# EAGLE design lcd1602a-connector (EAGLE 7.2.0)
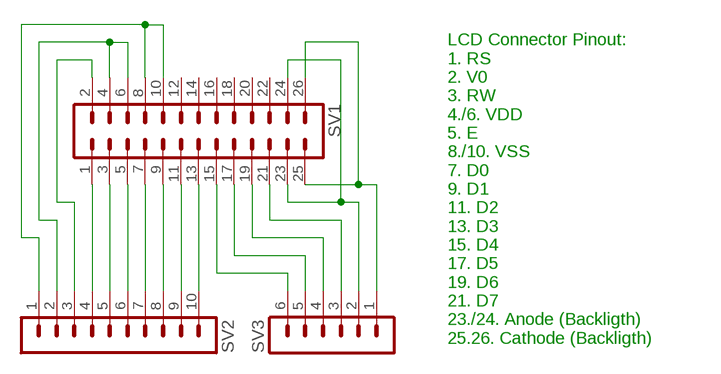
[diagram p0: schematic, sheet 1]

## Parts
SV1  ML26  [ML26]
SV2  MA10-1  [MA10-1]
SV3  MA06-1  [MA06-1]

## Nets
N$1: SV1.1 SV2.4
N$2: SV1.3 SV2.5
N$3: SV1.5 SV2.6
N$4: SV1.7 SV2.7
N$5: SV1.9 SV2.8
N$6: SV1.11 SV2.9
N$7: SV1.13 SV2.10
N$8: SV1.15 SV3.6
N$9: SV1.17 SV3.5
N$10: SV1.21 SV3.3
N$11: SV1.23 SV1.24 SV3.2
N$12: SV1.19 SV3.4
N$13: SV1.25 SV1.26 SV3.1
N$14: SV1.2 SV2.3
N$15: SV1.4 SV1.6 SV2.2
N$16: SV1.8 SV1.10 SV2.1
Unconnected: SV1.12 SV1.14 SV1.16 SV1.18 SV1.20 SV1.22

## Notes on the sheet
- LCD Connector Pinout:
  1. RS
  2. V0
  3. RW
  4./6. VDD
  5. E
  8./10. VSS
  7. D0
  9. D1
  11. D2
  13. D3
  15. D4
  17. D5
  19. D6
  21. D7
  23./24. Anode (Backligth)
  25.26. Cathode (Backligth)

## Library data of the parts
SV1 = con-harting-ml:ML26: HARTING; OC_FARNELL: unknown; OC_NEWARK: unknown
SV2 = con-lstb:MA10-1: PIN HEADER; OC_FARNELL: unknown; OC_NEWARK: unknown
SV3 = con-lstb:MA06-1: PIN HEADER; OC_FARNELL: unknown; OC_NEWARK: unknown

## Board
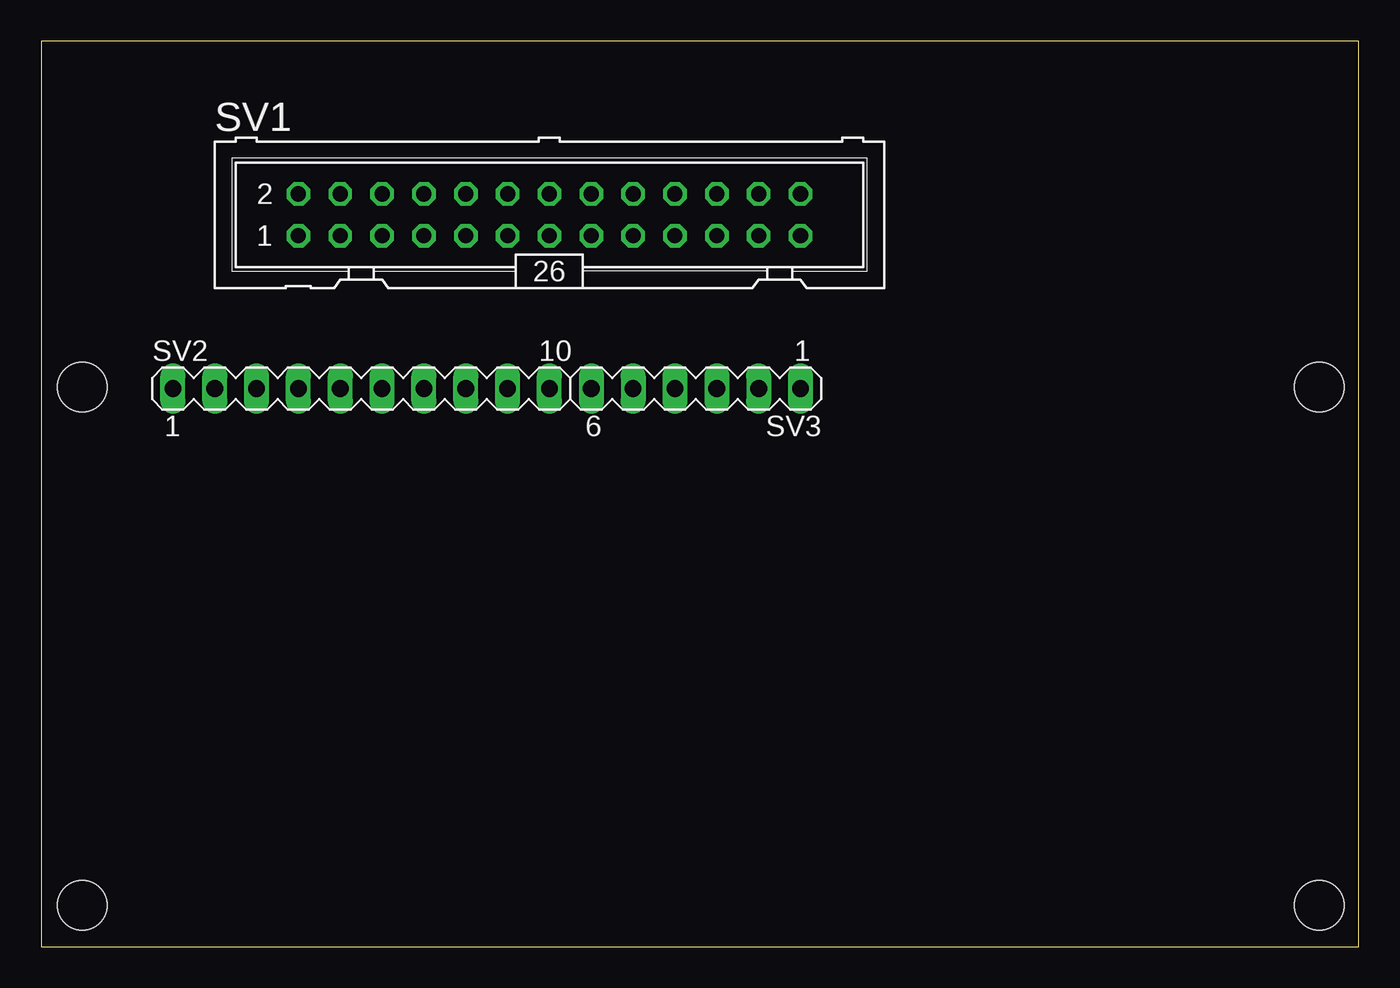
[diagram p1: board, top side]
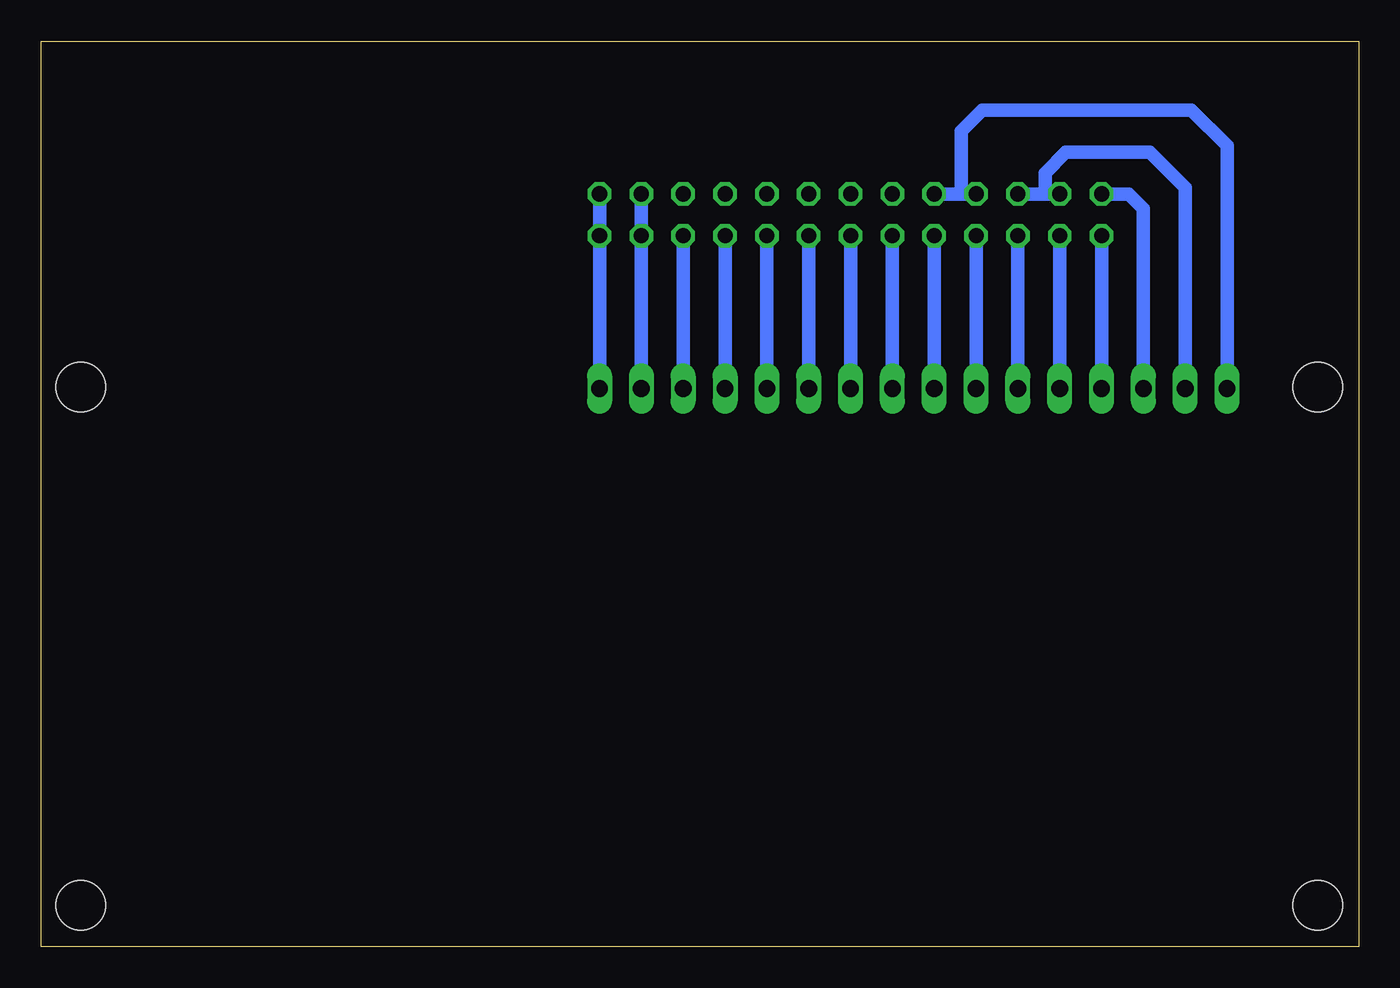
[diagram p2: board, bottom side, seen from below]

Size 80 x 55 mm. Coordinates in mm from the lower left corner, seen from the top.
Outline: 0,0 80,0 80,55 0,55 0,0
Copper layers (1*16): Top 0.035mm / dielectric 1.5mm / Bottom 0.035mm
Design rules "default": minimum track width 10mil, minimum drill 24mil, track to track 8mil, track to pad 8mil, pad to pad 8mil, via to via 8mil, smd to smd 8mil, copper to edge 40mil, drill to drill 8mil, minimum pad ring 10mil, minimum via ring 8mil, stop-mask expansion 4mil, vias tented up to drill 0mil, thermal gap 10mil
Holes 3 mm at 2.5,34 77.6,34 2.5,2.5 77.6,2.5

### Footprints (pad centres in the part's own frame; a part is rotated, then mirrored left to right if it is on the bottom)
ML26 = drill 0.914 octagon: 1 -15.24,-1.27; 2 -15.24,1.27; 3 -12.7,-1.27; 4 -12.7,1.27; 5 -10.16,-1.27; 6 -10.16,1.27; 7 -7.62,-1.27; 8 -7.62,1.27; 9 -5.08,-1.27; 10 -5.08,1.27; 11 -2.54,-1.27; 12 -2.54,1.27; 13 0,-1.27; 14 0,1.27; 15 2.54,-1.27; 16 2.54,1.27; 17 5.08,-1.27; 18 5.08,1.27; 19 7.62,-1.27; 20 7.62,1.27; 21 10.16,-1.27; 22 10.16,1.27; 23 12.7,-1.27; 24 12.7,1.27; 25 15.24,-1.27; 26 15.24,1.27
MA10-1 = drill 1.016 long: 1 -11.43,0; 2 -8.89,0; 3 -6.35,0; 4 -3.81,0; 5 -1.27,0; 6 1.27,0; 7 3.81,0; 8 6.35,0; 9 8.89,0; 10 11.43,0
MA06-1 = drill 1.016 long: 1 -6.35,0; 2 -3.81,0; 3 -1.27,0; 4 1.27,0; 5 3.81,0; 6 6.35,0

### Placement (x,y rotation side)
SV1  30.86,44.45 0 top
SV2  19.43,33.9 0 top
SV3  39.75,33.9 180 top

### Tracks (layer width: path | path; a pad name or v marks a point on that pad's centre or on a via)
N$1
  Bottom 0.813: SV2.4 SV1.1
N$2
  Bottom 0.813: SV2.5 SV1.3
N$3
  Bottom 0.813: SV2.6 SV1.5
N$4
  Bottom 0.813: SV2.7 SV1.7
N$5
  Bottom 0.813: SV2.8 SV1.9
N$6
  Bottom 0.813: SV2.9 SV1.11
N$7
  Bottom 0.813: SV2.10 SV1.13
N$8
  Bottom 0.813: SV3.6 SV1.15
N$9
  Bottom 0.813: SV3.5 SV1.17
N$10
  Bottom 0.813: SV3.3 SV1.21
N$11
  Bottom 0.813: SV1.24 SV1.23 SV3.2
N$12
  Bottom 0.813: SV3.4 SV1.19
N$13
  Bottom 0.813: SV1.26 SV1.25 SV3.1
N$14
  Bottom 0.813: SV2.3 13.08,44.83 13.97,45.72 SV1.2
N$15
  Bottom 0.813: SV2.2 10.54,46.1 12.7,48.26 17.78,48.26 19.05,46.99 19.05,45.72 | SV1.4 19.05,45.72 | 19.05,45.72 SV1.6
N$16
  Bottom 0.813: SV2.1 8,48.64 10.16,50.8 22.86,50.8 24.13,49.53 24.13,45.72 | SV1.8 24.13,45.72 | 24.13,45.72 SV1.10